# EAGLE design stereo_to_5.1_v2 (EAGLE 6.4)
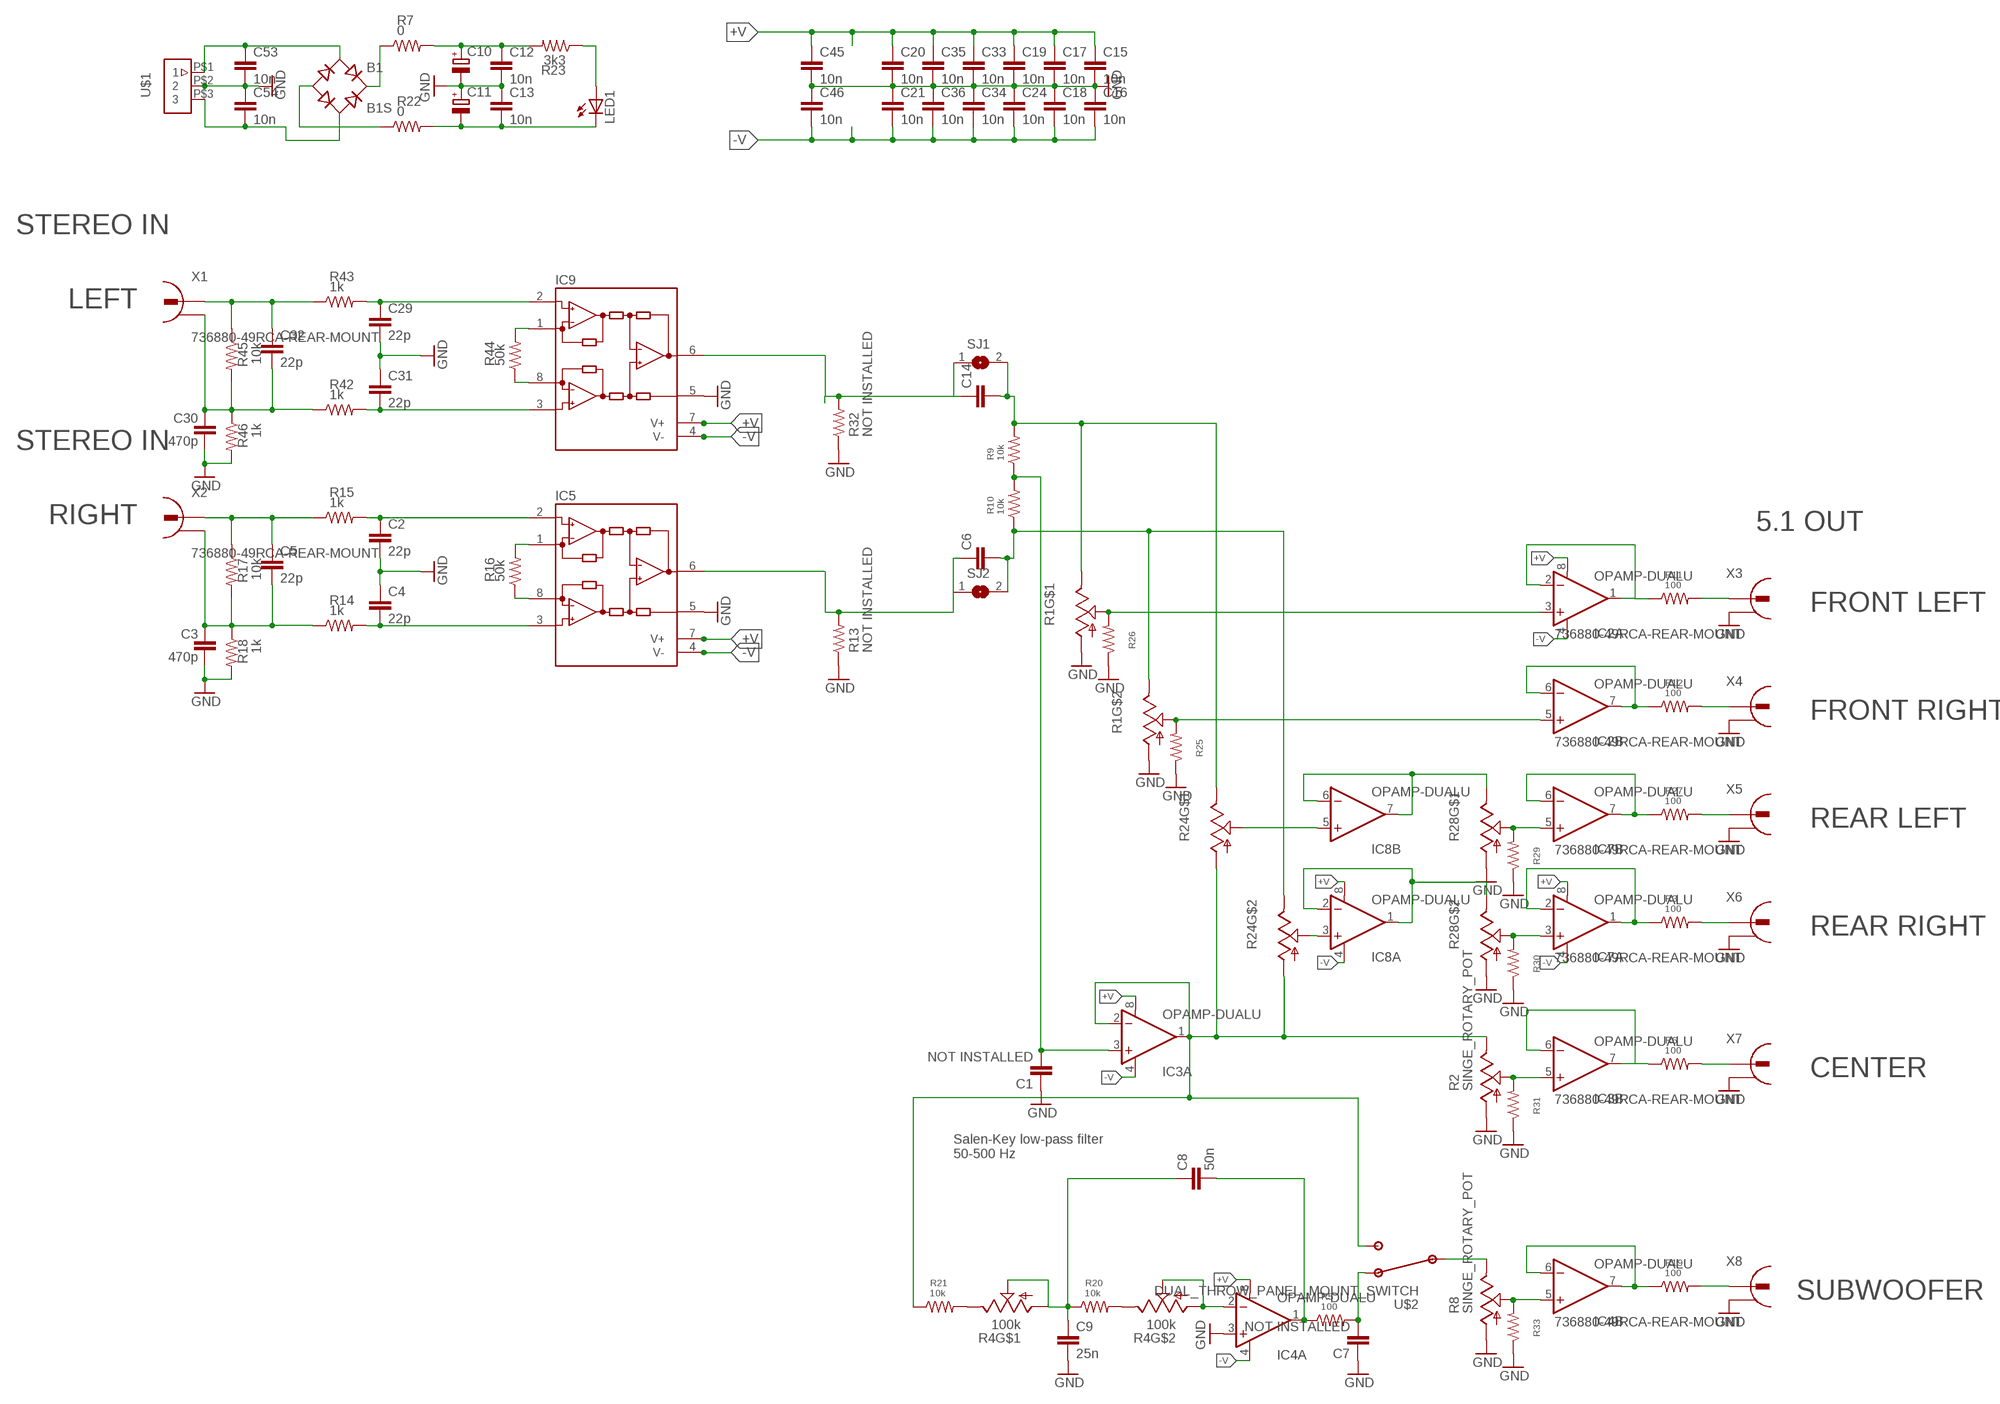
[diagram p0: schematic, sheet 1]

## Parts
B1  B1S  [MBS]
C1  NOT INSTALLED  C-EUC1206  [C1206]
C2  22p  C-EUC1206  [C1206]
C3  470p  C-EUC1206  [C1206]
C4  22p  C-EUC1206  [C1206]
C5  22p  C-EUC1206  [C1206]
C6  C-EUC4532  [C4532]
C7  NOT INSTALLED  C-EUC1206  [C1206]
C8  50n  C-EUC1206  [C1206]
C9  25n  C-EUC1206  [C1206]
C10  CPOL-EUSANYO_SMD_F12  [SANYO-OSCON_SMD_F12]
C11  CPOL-EUSANYO_SMD_F12  [SANYO-OSCON_SMD_F12]
C12  10n  C-EUC1206  [C1206]
C13  10n  C-EUC1206  [C1206]
C14  C-EUC4532  [C4532]
C15  10n  C-EUC1206  [C1206]
C16  10n  C-EUC1206  [C1206]
C17  10n  C-EUC1206  [C1206]
C18  10n  C-EUC1206  [C1206]
C19  10n  C-EUC1206  [C1206]
C20  10n  C-EUC1206  [C1206]
C21  10n  C-EUC1206  [C1206]
C24  10n  C-EUC1206  [C1206]
C29  22p  C-EUC1206  [C1206]
C30  470p  C-EUC1206  [C1206]
C31  22p  C-EUC1206  [C1206]
C32  22p  C-EUC1206  [C1206]
C33  10n  C-EUC1206  [C1206]
C34  10n  C-EUC1206  [C1206]
C35  10n  C-EUC1206  [C1206]
C36  10n  C-EUC1206  [C1206]
C45  10n  C-EUC1206  [C1206]
C46  10n  C-EUC1206  [C1206]
C53  10n  C-EUC1206  [C1206]
C54  10n  C-EUC1206  [C1206]
IC2  OPAMP-DUALU  [SO08]
IC3  OPAMP-DUALU  [SO08]
IC4  OPAMP-DUALU  [SO08]
IC5  ad620  INA118U  [SO08]
IC7  OPAMP-DUALU  [SO08]
IC8  OPAMP-DUALU  [SO08]
IC9  ad620  INA118U  [SO08]
LED1  LEDCHIPLED_1206  [CHIPLED_1206]
R1  TRIM_US-ROTARY  [DUAL_GANGED_ROTARY_POT]
R2  SINGE_ROTARY_POT  [SINGLE_ROTARY_POT]
R3  100  R-US_M1206  [M1206]
R4  100k  TRIM_US-ROTARY  [DUAL_GANGED_ROTARY_POT]
R5  100  R-US_M1206  [M1206]
R6  100  R-US_M1206  [M1206]
R7  0  R-US_M1206  [M1206]
R8  SINGE_ROTARY_POT  [SINGLE_ROTARY_POT]
R9  10k  R-US_M1206  [M1206]
R10  10k  R-US_M1206  [M1206]
R11  100  R-US_M1206  [M1206]
R12  100  R-US_M1206  [M1206]
R13  NOT INSTALLED  R-US_M1206  [M1206]
R14  1k  R-US_M1206  [M1206]
R15  1k  R-US_M1206  [M1206]
R16  50k  R-US_M1206  [M1206]
R17  10k  R-US_M1206  [M1206]
R18  1k  R-US_M1206  [M1206]
R19  100  R-US_M1206  [M1206]
R20  10k  R-US_M1206  [M1206]
R21  10k  R-US_M1206  [M1206]
R22  0  R-US_M1206  [M1206]
R23  3k3  R-US_M1206  [M1206]
R24  TRIM_US-ROTARY  [DUAL_GANGED_ROTARY_POT]
R25  R-US_M1206  [M1206]
R26  R-US_M1206  [M1206]
R27  100  R-US_M1206  [M1206]
R28  TRIM_US-ROTARY  [DUAL_GANGED_ROTARY_POT]
R29  R-US_M1206  [M1206]
R30  R-US_M1206  [M1206]
R31  R-US_M1206  [M1206]
R32  NOT INSTALLED  R-US_M1206  [M1206]
R33  R-US_M1206  [M1206]
R42  1k  R-US_M1206  [M1206]
R43  1k  R-US_M1206  [M1206]
R44  50k  R-US_M1206  [M1206]
R45  10k  R-US_M1206  [M1206]
R46  1k  R-US_M1206  [M1206]
SJ1  SJ  [SJ]
SJ2  SJ  [SJ]
U$1  3-PIN-JST-CONN-1.25MM-PITCH  [S3B-PH-VERTICAL]
U$2  DUAL_THROW_PANEL_MOUNT_SWITCH  [PANEL_MOUNT_DUAL_THROW_SWITCH]
X1  736880-49RCA-REAR-MOUNT  [RCA-REAR-MOUNT]
X2  736880-49RCA-REAR-MOUNT  [RCA-REAR-MOUNT]
X3  736880-49RCA-REAR-MOUNT  [RCA-REAR-MOUNT]
X4  736880-49RCA-REAR-MOUNT  [RCA-REAR-MOUNT]
X5  736880-49RCA-REAR-MOUNT  [RCA-REAR-MOUNT]
X6  736880-49RCA-REAR-MOUNT  [RCA-REAR-MOUNT]
X7  736880-49RCA-REAR-MOUNT  [RCA-REAR-MOUNT]
X8  736880-49RCA-REAR-MOUNT  [RCA-REAR-MOUNT]

## Nets
+V: C10.+ C12.1 C15.1 C17.1 C19.1 C20.1 C33.1 C35.1 C45.1 IC3.8(A:V+) IC5.7(V+) IC7.8(A:V+) IC8.8(A:V+) IC9.7(V+) R7.2 R23.2
-V: C11.- C13.2 C16.2 C18.2 C21.2 C24.2 C34.2 C36.2 C46.2 IC3.4(A:V-) IC5.4(V-) IC7.4(A:V-) IC8.4(A:V-) IC9.4(V-) LED1.C R22.2
GND: C1.1 C2.2 C3.2 C4.1 C7.1 C9.2 C10.- C11.+ C12.2 C13.1 C15.2 C16.1 C17.2 C18.1 C19.2 C20.2 C21.1 C24.1 C29.2 C30.2 C31.1 C33.2 C34.1 C35.2 C36.1 C45.2 C46.1 C53.2 C54.1 IC4.3(A:+IN) IC5.5(REF) IC9.5(REF) R1.P$2(RA) R1.P$5(RA) R2.P$2(RA) R8.P$2(RA) R13.1 R18.2 R25.1 R26.1 R28.P$2(RA) R28.P$5(RA) R29.1 R30.1 R31.1 R32.1 R33.1 R46.2 U$1.P$2 X3.RING X4.RING X5.RING X6.RING X7.RING X8.RING
N$1: C14.2 R1.P$3(RB) R9.2 R24.P$3(RB) SJ1.2
N$2: C7.2 R5.2 U$2.LEFT(NC)
N$3: R8.P$3(RB) U$2.MIDDLE(COMMON)
N$4: IC4.5(B:+IN) R8.P$1(RW) R33.2
N$5: IC4.6(B:-IN) IC4.7(B:OUT) R19.1
N$6: C6.2 R1.P$6(RB) R10.1 R24.P$6(RB) SJ2.2
N$7: IC7.5(B:+IN) R28.P$1(RW) R29.2
N$8: IC2.1(A:OUT) IC2.2(A:-IN) R11.1
N$9: IC2.3(A:+IN) R1.P$1(RW) R26.2
N$10: IC2.5(B:+IN) R1.P$4(RW) R25.2
N$11: IC2.6(B:-IN) IC2.7(B:OUT) R12.1
N$12: IC3.5(B:+IN) R2.P$1(RW) R31.2
N$13: R11.2 X3.SIGNAL
N$14: R12.2 X4.SIGNAL
N$15: C8.2 IC4.1(A:OUT) R5.1
N$16: IC7.3(A:+IN) R28.P$4(RW) R30.2
N$17: C2.1 IC5.2(-IN) R15.2
N$18: C3.1 C5.2 R14.1 R17.2 R18.1 X2.RING
N$19: C5.1 R15.1 R17.1 X2.SIGNAL
N$20: IC5.8(RG) R16.1
N$21: C4.2 IC5.3(+IN) R14.2
N$22: IC5.1(RG) R16.2
N$23: C6.1 IC5.6(OUT) R13.2 SJ2.1
N$24: IC7.1(A:OUT) IC7.2(A:-IN) R3.1
N$25: R3.2 X6.SIGNAL
N$26: R4.P$6(RB) R20.2
N$27: R4.P$3(RB) R21.2
N$28: C1.2 IC3.3(A:+IN) R9.1 R10.2
N$29: IC3.1(A:OUT) IC3.2(A:-IN) R2.P$3(RB) R21.1 R24.P$2(RA) R24.P$5(RA) U$2.RIGHT(NO)
N$30: IC7.6(B:-IN) IC7.7(B:OUT) R27.1
N$31: IC3.6(B:-IN) IC3.7(B:OUT) R6.1
N$32: R27.2 X5.SIGNAL
N$33: R6.2 X7.SIGNAL
N$34: IC8.5(B:+IN) R24.P$1(RW)
N$35: IC8.3(A:+IN) R24.P$4(RW)
N$36: IC8.1(A:OUT) IC8.2(A:-IN) R28.P$6(RB)
N$37: IC8.6(B:-IN) IC8.7(B:OUT) R28.P$3(RB)
N$38: R19.2 X8.SIGNAL
N$39: IC4.2(A:-IN) R4.P$4(RW) R4.P$5(RA)
N$42: C8.1 C9.1 R4.P$1(RW) R4.P$2(RA) R20.1
N$43: B1.AC1 C53.1 U$1.P$1
N$44: B1.+ R7.1
N$45: C14.1 IC9.6(OUT) R32.2 SJ1.1
N$46: B1.AC2 C54.2 U$1.P$3
N$47: C29.1 IC9.2(-IN) R43.2
N$48: C30.1 C32.2 R42.1 R45.2 R46.1 X1.RING
N$49: C32.1 R43.1 R45.1 X1.SIGNAL
N$50: IC9.8(RG) R44.1
N$51: C31.2 IC9.3(+IN) R42.2
N$52: B1.- R22.1
N$53: IC9.1(RG) R44.2
N$55: LED1.A R23.1

## Notes on the sheet
- STEREO IN
- LEFT
- STEREO IN
- RIGHT
- 5.1 OUT
- FRONT LEFT
- FRONT RIGHT
- REAR LEFT
- REAR RIGHT
- CENTER
- Salen-Key low-pass filter
  50-500 Hz
- SUBWOOFER

## Power pins joined to a net without a drawn wire
+V: IC2.8(A:V+) IC4.8(A:V+)
-V: IC2.4(A:V-) IC4.4(A:V-)

## Library data of the parts
B1 = rectifier:B*S: Surface Mount Glass Passivated Bridge Rectifiers Source: Comchip Bridge Rectifiers B05S-G_B10S-G.pdf
C1-C9 C12-C21 C24 C29-C36 C45 C46 C53 C54 = rcl:C-EU: CAPACITOR, European symbol
C10 C11 = stereo_5.1_mixer:CPOL-EU: POLARIZED CAPACITOR, European symbol
IC2-IC4 IC7 IC8 = SparkFun:OPAMP-DUAL: Operational Amplifier
IC5 IC9 = stereo_5.1_mixer:INA118: Instrumentation Amplifier Precision, Low Power; MF: TEXAS INSTRUMENTS; MPN: INA118U; OC_FARNELL: 1212404; OC_NEWARK: 04M6168
LED1 = led:LED: LED OSRAM: - CHIPLED LG R971, LG N971, LY N971, LG Q971, LY Q971, LO R971, LY R971 LH N974, LH R974 LS Q976, LO Q976, LY Q976 LO Q996 - Hyper CHIPLED LW Q18S LB Q993, LB Q99A, LB R99A - SideLED LS A670, LO A670, LY A670, LG A670, LP A670 LB A673, LV A673, LT A673, LW A673 LH A674 LY A675 LS A676, LA A676, LO A676, LY A676, LW A676 LS A679, LY A679, LG A679 - Hyper Micro SIDELED® LS Y876, LA Y876, LO Y876, LY Y876 LT Y87S - SmartLED LW L88C, LW L88S LB L89C, LB L89S, LG L890 LS L89K, LO L89K, LY L89K LS L896, LA L896, LO L896, LY L896 - TOPLED LS T670, LO T670, LY T670, LG T670, LP T670 LSG T670, LSP T670, LSY T670, LOP T670, LYG T670 LG T671, LOG T671, LSG T671 LB T673, LV T673, LT T673, LW T673 LH T674 LS T676, LA T676, LO T676, LY T676, LB T676, LH T676, LSB T676, LW T676 LB T67C, LV T67C, LT T67C, LS T67K, LO T67K, LY T67K, LW E67C LS E67B, LA E67B, LO E67B, LY E67B, LB E67C, LV E67C, LT E67C LW T67C LS T679, LY T679, LG T679 LS T770, LO T770, LY T770, LG T770, LP T770 LB T773, LV T773, LT T773, LW T773 LH T774 LS E675, LA E675, LY E675, LS T675 LS T776, LA T776, LO T776, LY T776, LB T776 LHGB T686 LT T68C, LB T68C - Hyper Mini TOPLED® LB M676 - Mini TOPLED Santana® LG M470 LS M47K, LO M47K, LY M47K Source: http://www.osram.convergy.de LUXEON: - LUMILED® LXK2-PW12-R00, LXK2-PW12-S00, LXK2-PW14-U00, LXK2-PW14-V00 LXK2-PM12-R00, LXK2-PM12-S00, LXK2-PM14-U00 LXK2-PE12-Q00, LXK2-PE12-R00, LXK2-PE12-S00, LXK2-PE14-T00, LXK2-PE14-U00 LXK2-PB12-K00, LXK2-PB12-L00, LXK2-PB12-M00, LXK2-PB14-N00, LXK2-PB14-P00, LXK2-PB14-Q00 LXK2-PR12-L00, LXK2-PR12-M00, LXK2-PR14-Q00, LXK2-PR14-R00 LXK2-PD12-Q00, LXK2-PD12-R00, LXK2-PD12-S00 LXK2-PH12-R00, LXK2-PH12-S00 LXK2-PL12-P00, LXK2-PL12-Q00, LXK2-PL12-R00 Source: www.luxeon.com KINGBRIGHT: KA-3528ASYC Source: www.kingbright.com
R1 R4 R24 R28 = stereo_5.1_mixer:TRIM_US-: POTENTIOMETER
R2 R8 = stereo_5.1_mixer:SINGE_ROTARY_POT
R3 R5-R7 R9-R23 R25-R27 R29-R33 R42-R46 = rcl:R-US_: RESISTOR, American symbol
SJ1 SJ2 = jumper:SJ: SMD solder JUMPER
U$1 = stereo_5.1_mixer:3-PIN-JST-CONN-1.25MM-PITCH
U$2 = stereo_5.1_mixer:DUAL_THROW_PANEL_MOUNT_SWITCH
X1-X8 = stereo_5.1_mixer:736880-49: Cinch Connector ( RCA Jack )

## Board
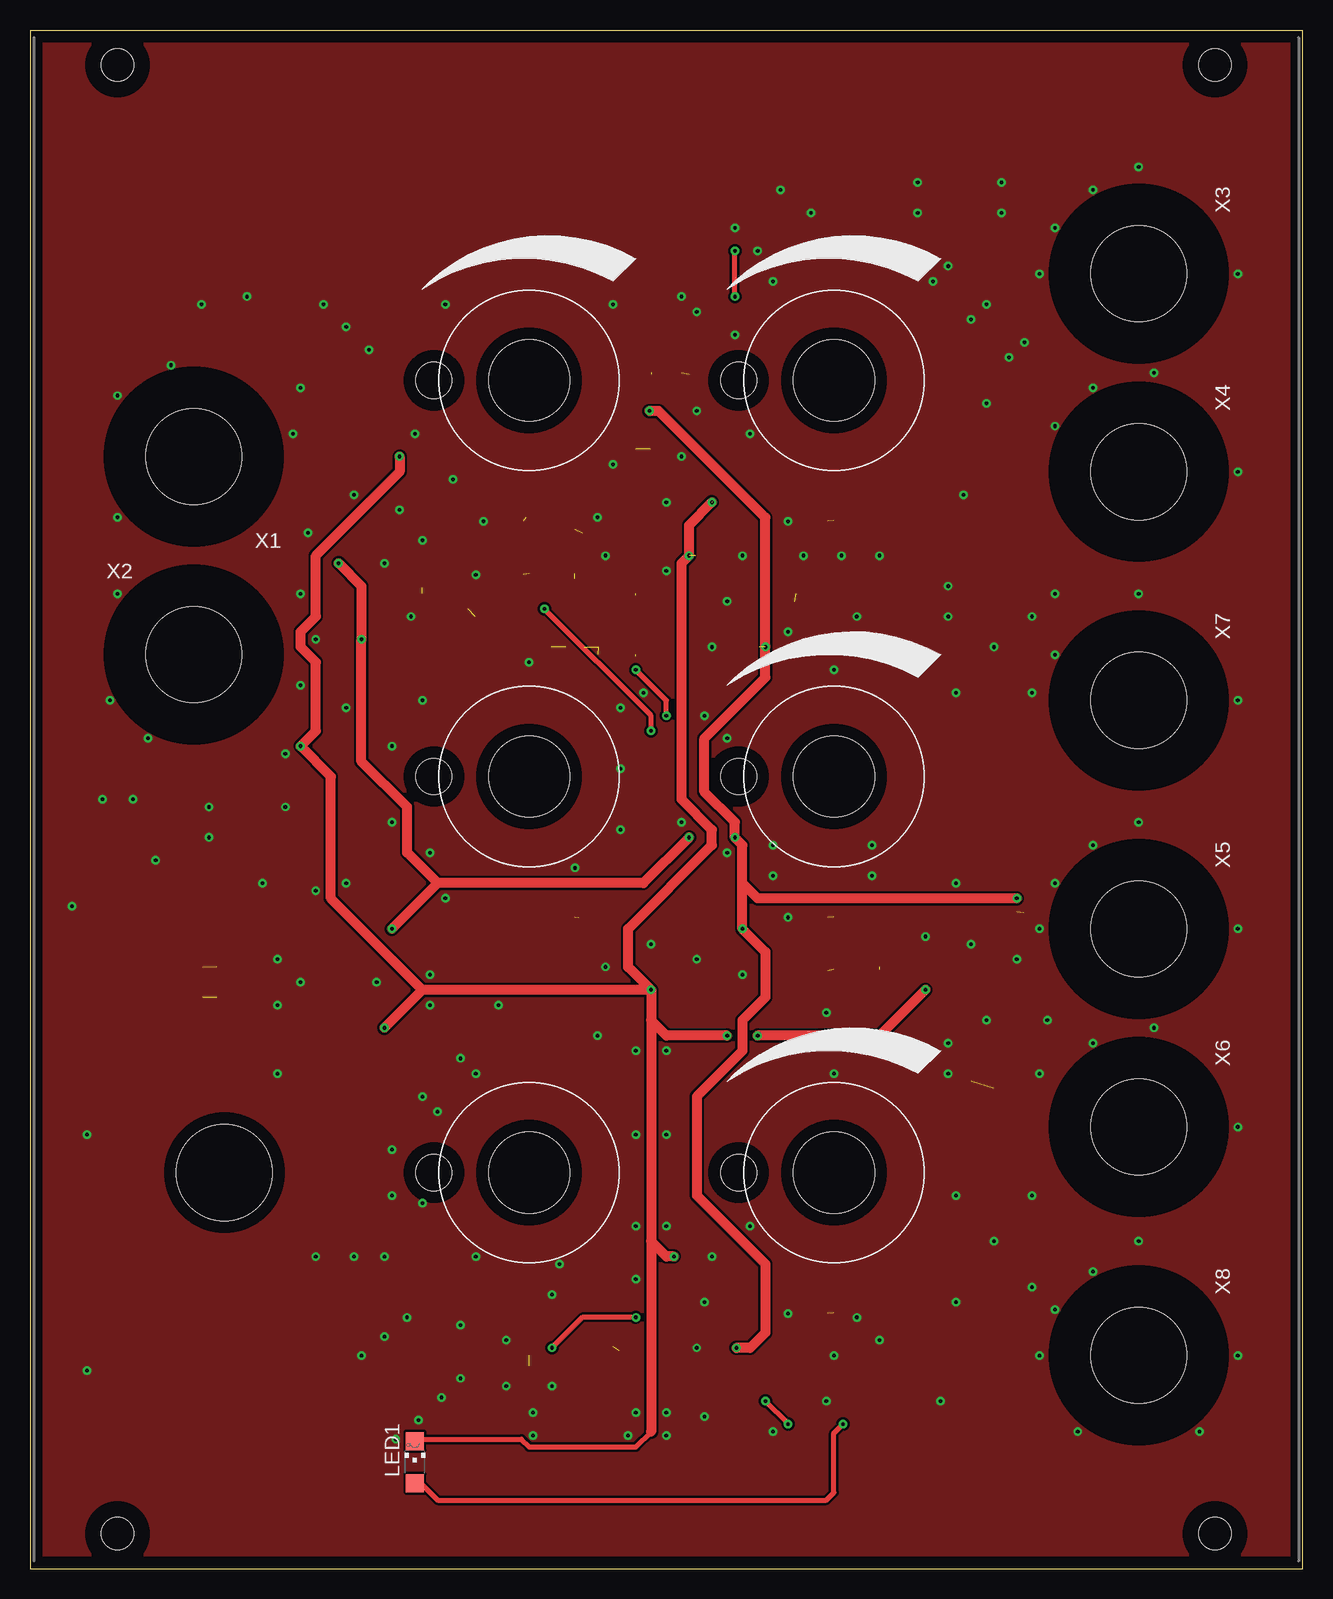
[diagram p1: board, top side]
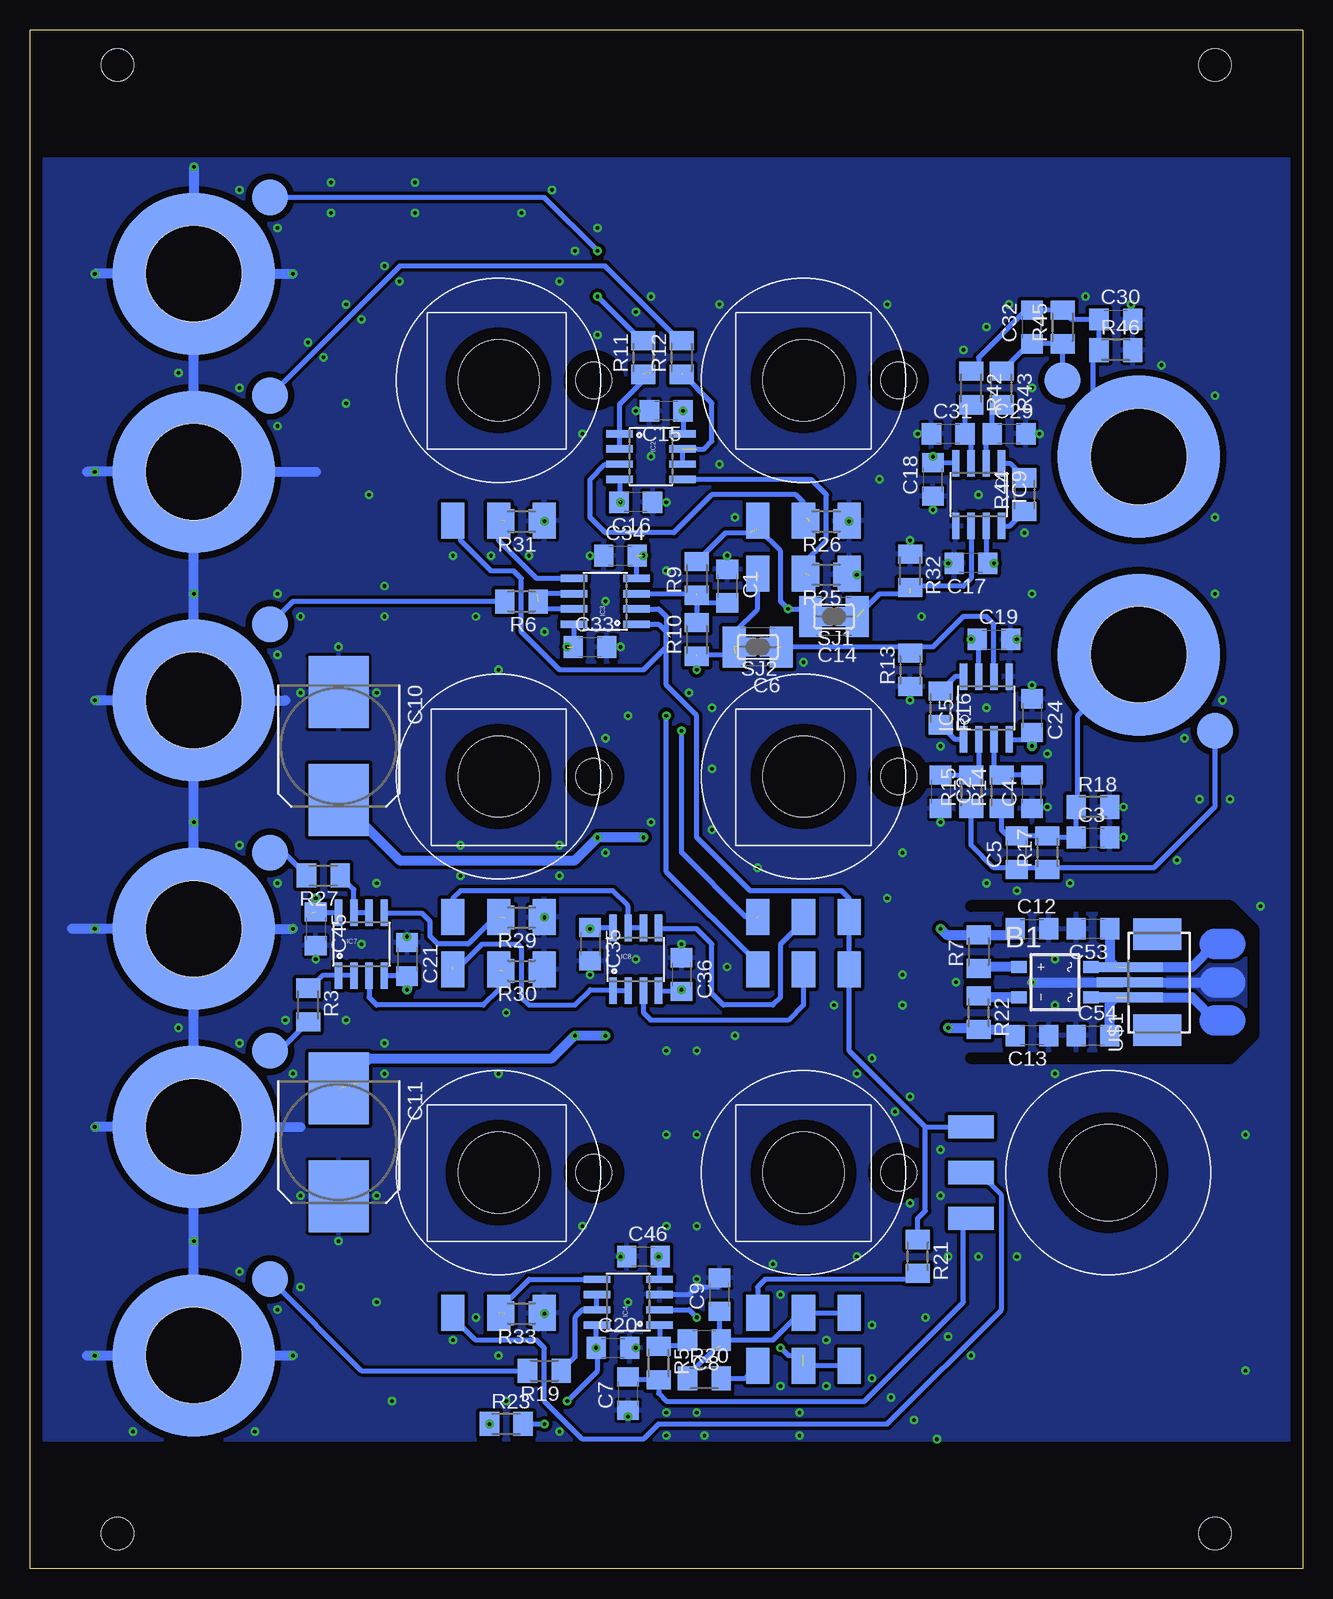
[diagram p2: board, bottom side, seen from below]

Size 106.05 x 128.27 mm. Coordinates in mm from the lower left corner, seen from the top.
Outline: 0,0 106.04,0 106.04,128.27 0,128.27 0,0
Copper layers (1*16): Top 0.035mm / dielectric 1.5mm / Bottom 0.035mm
Design rules "default *": minimum track width 10mil, minimum drill 24mil, track to track 8mil, track to pad 8mil, pad to pad 8mil, via to via 8mil, smd to smd 8mil, copper to edge 40mil, drill to drill 8mil, minimum pad ring 10mil, minimum via ring 8mil, stop-mask expansion 4mil, vias tented up to drill 0mil, thermal gap 10mil
Holes 2.7 mm at 7.3,2.92 7.3,125.35 98.74,125.35 98.74,2.92
tRestrict: area 5,0.6 to 9.6,5.2; area 5,123.1 to 9.6,127.6; area 96.5,123.1 to 101,127.6; area 96.5,0.6 to 101,5.2
bRestrict: 5 lines

### Footprints (pad centres in the part's own frame; a part is rotated, then mirrored left to right if it is on the bottom)
MBS = smd 1 x 1.3: + -1.27,-3; - 1.27,-3; AC1 -1.27,3; AC2 1.27,3
C1206 = smd 1.6 x 1.8: 1 -1.4,0; 2 1.4,0
C4532 = smd 1.9 x 3.4: 1 -1.95,0; 2 1.95,0
SANYO-OSCON_SMD_F12 = smd 6 x 5: + 4.5,0; - -4.5,0
SO08 = smd 0.61 x 2.21: 1 -1.905,-2.616; 2 -0.635,-2.616; 3 0.635,-2.616; 4 1.905,-2.616; 5 1.905,2.616; 6 0.635,2.616; 7 -0.635,2.616; 8 -1.905,2.616
CHIPLED_1206 = smd 1.5 x 1.5: A 0,-1.75; C 0,1.75
DUAL_GANGED_ROTARY_POT = smd 1.93 x 3 bottom: P$1 0,-11.7; P$2 -3.81,-11.7; P$3 3.81,-11.7; P$4 0,-16.098; P$5 -3.81,-16.098; P$6 3.81,-16.098 | hole 6.75: 0,0 | hole 3: -7.938,0
SINGLE_ROTARY_POT = smd 1.93 x 3 bottom: P$1 0,-11.7; P$2 -3.81,-11.7; P$3 3.81,-11.7 | hole 6.75: 0,0 | hole 3: -7.938,0
M1206 = smd 1.6 x 2: 1 -1.4,0; 2 1.4,0
SJ = smd 1.168 x 1.6: 1 -0.762,0; 2 0.762,0
S3B-PH-VERTICAL = smd 0.8 x 5.5: P$1 -1.25,-2; P$2 0,-2; P$3 1.25,-2 | smd 2.6 x 4: P$4 -4,0.27; P$5 4,0.27
PANEL_MOUNT_DUAL_THROW_SWITCH = smd 1.93 x 3.81 bottom: LEFT -3.81,-11.43; MIDDLE 0,-11.43; RIGHT 3.81,-11.43 | hole 8: 0,0
RCA-REAR-MOUNT = smd 13.5 x 13.5 bottom: RING 0,0 | smd 3 x 3 bottom: SIGNAL 6.35,6.35 | hole 8: 0,0

### Placement (x,y rotation side)
B1  20.64,48.9 270 bottom
C1  47.94,81.92 270 bottom
C2  30.16,64.77 270 bottom
C3  17.46,60.96 0 bottom
C4  22.54,64.77 90 bottom
C5  23.81,59.69 90 bottom
C6  45.4,76.83 180 bottom
C7  56.2,14.61 90 bottom
C8  49.85,19.05 180 bottom
C9  48.58,22.86 90 bottom
C10  80.33,68.58 270 bottom
C11  80.33,35.56 270 bottom
C12  22.54,53.34 0 bottom
C13  22.54,44.45 180 bottom
C14  39.05,79.38 180 bottom
C15  53.02,96.52 180 bottom
C16  55.56,88.9 180 bottom
C17  27.62,83.82 180 bottom
C18  30.8,90.81 90 bottom
C19  25.72,77.47 0 bottom
C20  57.47,18.41 0 bottom
C21  74.61,50.8 270 bottom
C24  22.54,71.12 270 bottom
C29  24.45,94.61 0 bottom
C30  15.56,104.14 0 bottom
C31  29.53,94.61 0 bottom
C32  22.54,103.5 90 bottom
C33  59.37,76.83 0 bottom
C34  56.83,84.45 0 bottom
C35  59.37,52.07 270 bottom
C36  51.75,49.53 270 bottom
C45  82.23,53.34 270 bottom
C46  54.93,26.04 0 bottom
C53  17.46,53.34 180 bottom
C54  17.46,44.45 0 bottom
IC2  54.29,92.71 270 bottom
IC3  58.1,80.64 90 bottom
IC4  56.2,22.23 90 bottom
IC5  26.35,71.75 0 bottom
IC7  78.42,52.07 0 bottom
IC8  55.56,50.8 0 bottom
IC9  26.99,89.53 180 bottom
LED1  32.07,8.89 0 top
R1  41.59,99.06 0 top
R2  66.99,99.06 0 top
R3  82.87,46.99 270 bottom
R4  41.59,33.02 0 top
R5  53.66,17.14 270 bottom
R6  65.09,80.64 180 bottom
R7  26.99,51.44 90 bottom
R8  66.99,33.02 0 top
R9  50.48,82.55 90 bottom
R10  50.48,77.47 90 bottom
R11  54.93,100.97 90 bottom
R12  51.75,100.97 90 bottom
R13  32.7,74.93 90 bottom
R14  25.08,64.77 90 bottom
R15  27.62,64.77 90 bottom
R16  30.16,71.75 270 bottom
R17  21.27,59.69 90 bottom
R18  17.46,63.5 0 bottom
R19  63.18,16.51 180 bottom
R20  49.85,15.88 0 bottom
R21  32.07,26.04 270 bottom
R22  26.99,46.35 270 bottom
R23  66.36,12.06 0 bottom
R24  41.59,66.04 0 top
R25  39.69,82.87 180 bottom
R26  39.69,87.31 180 bottom
R27  81.6,57.78 180 bottom
R28  66.99,66.04 0 top
R29  65.09,54.29 180 bottom
R30  65.09,49.85 180 bottom
R31  65.09,87.31 180 bottom
R32  32.7,83.19 270 bottom
R33  65.09,21.27 180 bottom
R42  27.62,98.42 270 bottom
R43  25.08,98.42 270 bottom
R44  23.18,89.53 90 bottom
R45  20,103.5 90 bottom
R46  15.56,101.6 0 bottom
SJ1  39.05,79.38 180 bottom
SJ2  45.4,76.83 180 bottom
U$1  12.38,48.9 270 bottom
U$2  16.19,33.02 90 top
X1  13.65,92.71 0 top
X2  13.65,76.2 180 top
X3  92.39,107.95 90 top
X4  92.39,91.44 90 top
X5  92.39,53.34 90 top
X6  92.39,36.83 90 top
X7  92.39,72.39 90 top
X8  92.39,17.78 90 top

### Tracks (layer width: path | path; a pad name or v marks a point on that pad's centre or on a via)
+V  (via drill 0.3, 0.3 pad 0.3)  (2 unrouted)
  Top 0.406: v63.18,12.06 v61.28,13.97
  Top 0.813: 59.37,57.15 v59.37,53.34 61.28,51.44 61.28,47.62 59.37,45.72 59.37,43.18 55.56,39.37 55.56,31.11 61.28,25.4 61.28,19.68 60.01,18.41 C20.1 | 59.37,57.15 59.37,60.33 v58.74,60.96 58.74,62.23 56.2,64.77 56.2,69.22 61.28,74.3 v61.28,76.83 61.28,87.63 52.39,96.52 C15.1 | v82.23,55.88 60.64,55.88 59.37,57.15 | v54.93,60.96 51.12,57.15 33.97,57.15 | v25.72,83.82 27.62,81.92 v27.62,77.47 27.62,67.31 31.43,63.5 31.43,59.69 33.97,57.15 | 33.97,57.15 v30.16,53.34
  Bottom 0.406: IC8.8 59.32,53.42 C35.1 | IC7.8 82.81,54.69 | C15.1 51.62,94.67 IC2.8 | IC4.8 58.87,20.27 C20.1 58.74,18.29 58.74,16.51 v61.28,13.97 | IC9.7 26.35,83.95 C17.1 v25.72,83.82 | IC5.7 26.99,77.34 C19.1 v27.62,77.47 | R23.2 v63.18,12.06 | IC3.8 60.72,76.89 C33.1
  Bottom 0.813: C35.1 v59.37,53.34 | C45.1 v82.23,55.88 | R7.2 24.45,52.84 C12.1 | R7.2 27.49,52.84 | v54.93,60.96 v58.74,60.96 60.64,59.05 75.25,59.05 80.27,64.08 C10.+ | v30.16,53.34 29.66,52.84 R7.2
  other vias: 51.62,96.52 58.87,18.41
-V  (via drill 0.3, 0.3 pad 0.3)  (4 unrouted)
  Top 0.406: 31.91,10.79 40.96,10.79 41.59,10.16 50.48,10.16 51.75,11.43
  Top 0.813: v51.75,48.26 51.75,45.72 | 51.75,45.72 51.75,27.3 | 51.75,27.3 51.75,11.43 | v51.75,48.26 49.85,50.16 49.85,53.34 56.83,60.33 56.83,61.59 54.29,64.14 54.29,83.82 v54.93,84.45 54.93,87 v56.83,88.9 | v74.61,48.26 70.8,44.45 v60.64,44.45 | v58.1,44.45 53.02,44.45 51.75,45.72 | LED1.C 31.91,10.79 | v53.66,26.04 53.02,26.04 51.75,27.3 | v30.8,92.71 30.8,91.44 23.81,84.45 23.81,79.38 22.54,78.11 22.54,76.83 23.81,75.56 23.81,69.85 v22.54,68.58 25.08,66.04 25.08,55.88 32.7,48.26 | v51.75,48.26 32.7,48.26 | 32.7,48.26 v29.53,45.09
  Bottom 0.406: IC8.4 51.81,48.18 C36.2 | IC7.4 74.67,49.45 C21.2 | IC2.4 56.91,88.95 C16.2 | IC3.4 55.49,84.4 | 53.58,25.96 53.58,25.98 C46.2 | IC4.4 53.58,25.96 | 53.58,25.96 v53.66,26.04 | C18.2 30.74,92.15 IC9.4 30.24,92.15 v30.8,92.71 | IC5.4 23.12,69.14 C24.2
  Bottom 0.813: C36.2 v51.75,48.26 | C21.2 v74.61,48.26 | v58.1,44.45 v60.64,44.45 62.55,42.55 77.79,42.55 78.42,41.91 78.42,40.64 | C13.2 24.45,44.95 R22.2 27.12,45.09 v29.53,45.09 | v22.54,68.58 C24.2
GND  (via drill 0.3)
  Bottom 0.406: IC4.3 51.12,22.86 50.48,23.5 48.71,23.5 | 38.05,87.63 R1.P$2
  Bottom 0.813: U$1.P$2 7.3,48.9 | X8.RING v84.14,17.78 | 101.28,17.78 X8.RING | X8.RING X6.RING | X6.RING X5.RING | X5.RING X7.RING | X7.RING X4.RING | X4.RING X3.RING | v92.39,116.84 X3.RING | X3.RING v84.14,107.95 | X3.RING v100.65,107.95 | X4.RING 101.28,91.44 | X4.RING 82.23,91.44 | X7.RING v100.65,72.39 | X7.RING 84.77,72.39 | X5.RING 102.55,53.34 | X5.RING v84.14,53.34 | X6.RING v100.65,36.83 | X6.RING 83.5,36.83 | v22.54,48.9 14.92,48.9
  Bottom 2.54: 7.3,48.9 6.03,48.9
  other vias: 31.75,79.38 29.53,83.82 23.81,77.47 22.54,73.66 30.8,88.27 24.45,105.41 28.26,101.6 74.61,52.7 82.23,50.8 55.56,18.41 56.2,22.23 56.2,12.7 56.83,26.04 37.15,82.87 32.7,85.72 30.16,62.23 21.27,63.5 14.92,63.5 32.7,72.39 47.94,84.45 59.37,84.45 87.31,11.43 27.62,17.78 31.43,20.95 35.88,15.88 47.31,87.63 53.02,83.19 58.1,80.64 56.83,76.83 67.63,84.45 63.18,78.11 20.64,50.8 20.64,46.99 21.91,94.61 32.07,94.61 14.92,60.96 11.75,100.33 14.29,105.41 37.78,87.31 63.18,87.31 80.33,76.83 77.15,73.03 83.5,73.03 80.33,27.3 83.5,31.11 77.15,31.11 97.47,11.43 100.65,17.78 92.39,27.3 93.66,45.09 100.65,53.34 92.39,62.23 100.65,91.44 93.66,99.69 55.56,50.8 51.75,52.07 59.37,49.53 78.42,52.07 63.18,21.27 39.69,19.05 44.13,25.4 50.48,24.13 54.29,92.71 55.56,96.52 53.02,88.9 92.39,81.28 26.35,103.5 35.24,90.81 48.58,92.08 60.01,94.61 55.56,104.78 58.74,102.87 61.91,107.31 60.64,109.86 75.25,107.31 76.52,108.58 78.42,104.14 79.69,105.41 82.87,102.23 81.6,100.97 85.41,95.25 88.58,98.42 88.58,114.94 85.41,111.76 80.96,115.57 80.96,113.03 73.98,113.03 73.98,115.57 62.55,114.94 65.09,113.03 58.74,111.76 54.29,106.05 79.69,97.16 76.52,81.92 18.1,106.05 23.18,86.36 22.54,81.28 21.27,67.94 30.16,68.58 6.67,72.39 9.84,69.22 22.54,98.42 7.3,97.79 7.3,87.63 7.3,81.28 28.89,48.9 33.34,49.53 33.34,46.99 34.61,55.88 33.34,59.69 8.57,64.14 6.03,64.14 10.48,59.05 19.37,57.15 26.35,57.15 23.81,56.52 4.76,36.2 4.76,16.51 53.02,43.18 50.48,43.18 50.48,36.2 53.02,36.2 53.02,28.57 50.48,28.57 60.01,28.57 77.15,22.23 66.36,13.97 75.88,13.97 43.5,15.24 29.53,19.37 32.7,39.37 33.97,38.1 39.05,46.99 47.94,50.16 47.31,44.45 66.36,46.35 79.69,45.72 66.99,41.27 58.1,69.22 56.2,71.12 66.99,74.93 68.9,79.38 85.41,76.2 85.41,57.15 77.15,57.15 61.91,57.78 70.17,57.78 61.91,60.33 70.17,60.33 37.15,26.04 66.99,17.78 63.18,54.29 30.16,31.11 30.16,34.92 35.88,42.55 37.15,41.27 58.1,59.69 54.29,62.23 45.4,58.42 49.21,61.59 49.21,71.75 49.21,66.67 51.12,73.03 41.59,75.56 50.48,13.02 49.85,11.11 53.02,11.11 53.02,13.02 41.91,13.02 41.91,11.11 30.48,10.79 32.38,12.38 34.29,14.29 39.69,15.24 68.9,20.95 70.8,19.05 43.5,22.86 35.88,20.32 26.99,26.04 23.81,26.04 29.53,26.04 76.52,41.27 76.52,43.81 26.99,89.53 26.35,71.75 83.5,79.38 85.41,81.28 76.52,79.38 77.79,89.53 84.14,41.27 84.77,45.72 88.58,60.33 88.58,24.77 85.41,21.59 83.5,23.5 88.58,43.81 61.91,11.43 20.64,41.27 3.49,55.24 34.61,105.41 48.58,105.41 70.8,84.45 64.45,84.45 32.7,30.48
  pour Top: 106.36,0 -0.32,0 -0.32,128.27 106.36,128.27
  pour Bottom (isolate 0.305, rank 3): 106.36,117.47 0.32,117.47 0.32,10.79 106.36,10.79
N$1  (via drill 0.3)  (2 unrouted)
  Top 0.406: v51.75,69.85 51.75,71.12 v42.86,80.01
  Bottom 0.406: 45.72,54.29 46.35,54.29 51.75,59.69 v51.75,69.85 | R1.P$3 45.4,86.68 45.35,86.68 43.5,84.82 43.5,80.64 v42.86,80.01 40.96,80.01 40.96,79.42 C14.2 SJ1.2 | R9.2 48.07,86.36 46.04,86.36
N$2
  Bottom 0.406: C7.2 55.94,15.74 R5.2 53.66,14.61 53.02,13.97 36.51,13.97 28.26,22.23 28.26,28.57 U$2.LEFT
N$3
  Bottom 0.406: 70.8,21.59 R8.P$3 70.8,20.95 68.9,19.05 63.82,19.05 63.18,18.41 63.18,13.97 60.01,10.79 54.93,10.79 53.66,12.06 34.61,12.06 25.08,21.59 25.08,31.11 26.99,33.02 U$2.MIDDLE
N$4  (1 unrouted)
  Bottom 0.406: R8.P$1 66.99,21.59 64.45,24.13 IC4.5
N$5
  Bottom 0.406: R19.1 60.64,17.65 60.64,20.95 60.01,21.59 IC4.7 IC4.6
N$6  (via drill 0.3, 0.3 pad 0.3)  (4 unrouted)
  Top 0.406: v53.02,71.12 53.02,72.39 v50.48,74.93
  Bottom 0.406: R24.P$6 45.4,50.48 53.02,58.1 v53.02,71.12 | 50.71,75.97 50.48,76.2 47.31,76.2 47.31,78.11 45.4,80.01 45.4,82.55 | v50.48,74.93 R10.1
N$7  (1 unrouted)
  Bottom 0.406: R28.P$1 66.99,54.61 69.53,52.07 72.07,52.07 72.71,52.7 72.71,53.98 73.34,54.61 76.44,54.61 IC7.5
N$8  (1 unrouted)
  Bottom 0.406: IC2.2 IC2.1 56.91,97.08 54.29,99.69
N$9  (1 unrouted)
  Bottom 0.406: 41.32,87.63 R1.P$1 41.59,88.9 42.23,89.53 49.21,89.53 52.39,86.36 58.1,86.36 59.37,87.63 59.37,90.81 58.1,92.08 IC2.3
N$10  (1 unrouted)
  Bottom 0.406: R1.P$4 41.59,83.82 39.69,85.72 39.69,89.53 40.96,90.81 IC2.5 51.75,90.73
N$11  (2 unrouted)
  Bottom 0.406: IC2.7 IC2.6 | 50.48,93.34 49.85,93.34 49.21,93.98 49.21,97.16 51.75,99.69
N$12  (1 unrouted)
  Bottom 0.406: IC3.5 63.82,82.55 66.99,85.72 R2.P$1
N$13  (via drill 0.3)
  Top 0.406: v58.74,106.05 v58.74,109.86
  Bottom 0.406: R11.2 54.93,102.23 v58.74,106.05 | v58.74,109.86 63.18,114.3 X3.SIGNAL
N$14
  Bottom 0.406: X4.SIGNAL 75.25,108.58 58.1,108.58 51.88,102.36 R12.2
N$15
  Bottom 0.406: IC4.1 53.58,18.62 | 53.58,18.62 R5.1 | 53.58,18.62 51.68,18.62 C8.2
N$16  (1 unrouted)
  Bottom 0.406: R28.P$4 66.99,48.26 68.26,46.99 77.15,46.99 77.79,47.62 IC7.3
N$17
  Bottom 0.406: C2.1 R15.2 27.62,66.67 26.99,66.67 IC5.2
N$18
  Bottom 0.406: R14.1 25.08,61.59 24.58,61.09 C5.2 R17.2 21.14,60.96 C3.1 R18.1 18.73,63.63 18.73,71.12 16.32,73.53 X2.RING
N$19
  Bottom 0.406: X2.SIGNAL 7.3,63.5 12.38,58.42 14.92,58.42 21.27,58.42 | 21.27,58.42 24.45,58.42 | 24.45,58.42 25.72,58.42 27.62,60.33 R15.1 | R17.1 21.27,58.42 | C5.1 24.32,58.29 24.45,58.42
N$20
  Bottom 0.406: IC5.8 28.95,74.37 R16.1
N$21
  Bottom 0.406: IC5.3 25.72,66.81 R14.2 C4.2
N$22
  Bottom 0.406: IC5.1 28.95,69.14 R16.2
N$23  (2 unrouted)
  Bottom 0.406: IC5.6 25.72,78.74 26.35,79.38 28.26,79.38 30.8,76.83 32.7,76.83 | 32.7,76.83 43.5,76.83 | R13.2 32.7,76.83
N$24
  Bottom 0.406: IC7.2 IC7.1 81.67,49.45 82.87,48.26 R3.1
N$25
  Bottom 0.406: R3.2 85.28,43.18 X6.SIGNAL
N$26
  Bottom 0.406: R20.2 46.45,15.88 R4.P$6
N$27
  Bottom 0.406: R4.P$3 45.4,23.5 44.77,24.13 32.57,24.13 R21.2
N$28  (1 unrouted)
  Bottom 0.406: IC3.3 50.48,81.28 | 50.61,78.74 R10.2 R9.1 49.85,80.52 C1.2
N$29
  Bottom 0.406: IC3.2 53.66,80.01 53.02,79.38 53.02,78.11 | IC3.1 53.66,78.74 53.02,78.11 | 53.02,76.83 53.02,73.66 50.48,71.12 50.48,60.96 46.04,56.52 38.42,56.52 37.78,55.88 R24.P$2 R24.P$5 37.78,43.18 31.43,36.83 | 53.02,76.83 54.93,74.93 61.91,74.93 65.09,78.11 65.09,82.55 65.72,83.19 67.63,83.19 70.17,85.72 70.17,86.72 R2.P$3 | 53.02,76.83 53.02,78.11 | 31.43,36.83 U$2.RIGHT | R21.1 32.07,29.21 31.43,29.84 31.43,36.83
N$30
  Bottom 0.406: IC7.6 IC7.7
  Bottom 0.422: IC7.7 79.06,56.65 R27.1
N$31  (1 unrouted)
  Bottom 0.406: IC3.6 63.82,81.28 63.82,80.01 IC3.7
N$32
  Bottom 0.406: R27.2 84.9,59.69 X5.SIGNAL
N$33
  Bottom 0.406: R6.2 84.14,80.64 X7.SIGNAL
N$34
  Bottom 0.406: IC8.5 53.58,53.34 50.48,53.34 49.21,52.07 49.21,47.94 48.26,46.99 44.13,46.99 43.5,47.62 43.5,52.07 41.59,53.98 R24.P$1
N$35
  Bottom 0.406: R24.P$4 41.59,46.99 42.86,45.72 54.29,45.72 54.93,46.35 IC8.3
N$36  (1 unrouted)
  Bottom 0.406: 70.58,50.16 70.8,50.16 | IC8.2 IC8.1 57.54,48.26 59.37,48.26 60.64,46.99 64.45,46.99 65.09,47.62 65.09,51.75 65.4,52.07 68.36,52.07 70.48,49.94 R28.P$6
N$37
  Bottom 0.406: IC8.6 IC8.7 56.2,55.24 57.47,56.52 70.17,56.52 70.8,55.88 R28.P$3
N$38
  Bottom 0.406: X8.SIGNAL 78.42,16.51 R19.2
N$39  (via drill 0.3)  (1 unrouted)
  Top 0.406: v50.48,20.95 46.04,20.95 v43.5,18.41
  Bottom 0.406: R4.P$5 R4.P$4 | IC4.2 51.12,21.59 v50.48,20.95 | v43.5,18.41 42.86,17.78 41.59,17.78
N$42  (1 unrouted)
  Bottom 0.406: R4.P$2 R4.P$1 41.59,21.59 44.13,19.05 C8.1 48.58,19.05 | 48.58,19.05 C9.1 | 48.58,19.05 48.58,18.55 | 49.08,18.23 50.8,16.51 51.12,16.51 51.12,16 R20.1
N$43  (1 unrouted)
  Bottom 0.813: B1.AC1 15.56,50.16 | 15.56,50.16 9.21,50.16 7.3,52.07 | C53.1 16.06,50.67 15.56,50.16
  Bottom 2.54: 7.3,52.07 6.03,52.07
N$44
  Bottom 0.813: B1.+ 26.86,50.16 R7.1
N$45  (2 unrouted)
  Bottom 0.406: C14.1 SJ1.1 | IC9.6 27.62,82.55 28.26,81.92 32.07,81.92 32.7,81.28 35.24,81.28 36.51,80.01
N$46  (1 unrouted)
  Bottom 0.813: B1.AC2 15.56,47.62 | 15.56,47.62 9.21,47.62 7.3,45.72 | C54.2 16.06,47.12 15.56,47.62
  Bottom 2.54: 6.03,45.72 7.3,45.72
N$47
  Bottom 0.406: IC9.2 26.35,94.11 C29.1 25.85,96.26 R43.2
N$48
  Bottom 0.406: X1.RING 17.46,96.52 17.46,101.09 R46.1 C30.1 19.24,104.14 R45.2 | 20.13,105.54 20.13,104.78 20.26,104.91 R45.2 | R42.1 27.49,99.69 26.99,99.69 26.99,100.97 23.05,104.91 C32.2 R45.2
N$49
  Bottom 0.406: X1.SIGNAL R45.1 C32.1 23.05,101.6 23.31,101.6 R43.1 24.95,99.69
N$50
  Bottom 0.406: IC9.8 24.39,86.92 R44.1
N$51
  Bottom 0.406: IC9.3 27.62,94.11 C31.2 28.13,96.52 R42.2
N$52
  Bottom 0.813: B1.- 26.86,47.62 R22.1
N$53
  Bottom 0.406: IC9.1 24.39,92.15 R44.2
N$55  (via drill 0.3)
  Top 0.406: LED1.A 32.55,7.14 33.97,5.71 66.36,5.71 66.99,6.35 66.99,11.3 R23.1
  other vias: 67.76,12.06

### Text on the board
Reference: mounting hole vertical dist = 122.5 mm = 4.82" / PCB total height = 128.7 mm = 5.06" | mounting hole pitch = 0.2"
tDocu: OUT | FRONT | L | R | L | FRONT | CENTER | STEREO | IN | L | R | R | REAR | REAR | CENTER | MIX | REAR | MONO | L | STEREO | SUB | SUB / LPF | SUB / LPF | R | ON | SUB | 500 | OFF | 50 / Hz | Hz | SURROUND DECODER
bDocu: PWR IN